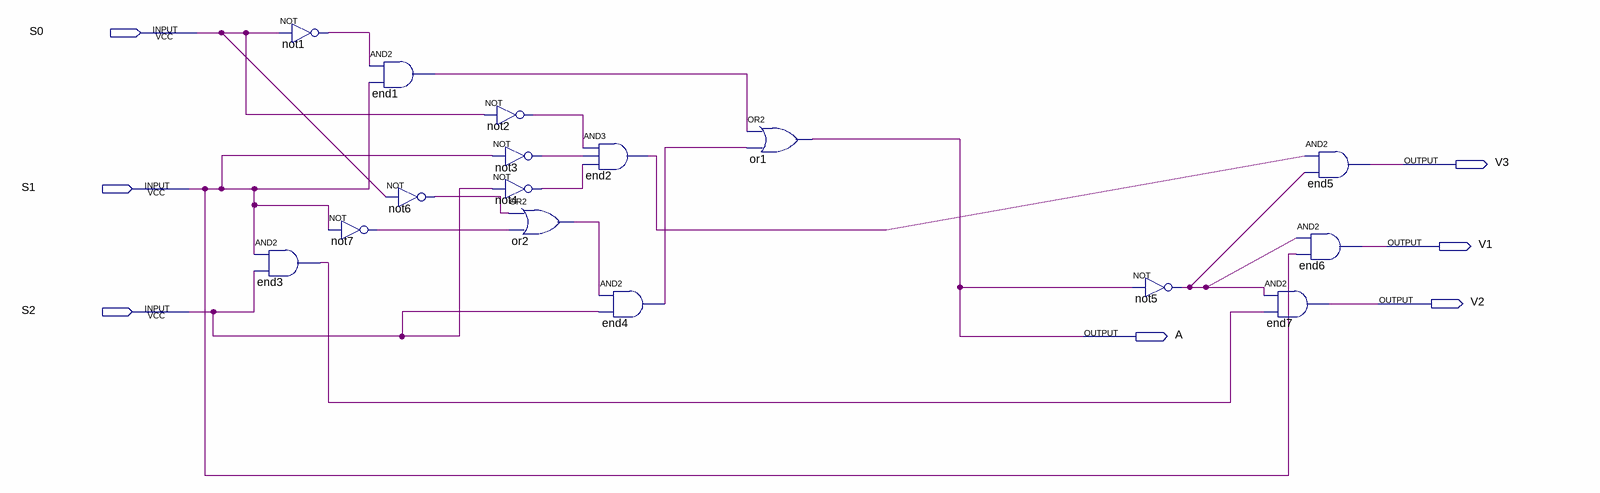
[diagram p0: schematic sheet]
// Quartus schematic exercicio.bdf as structural Verilog: 16 symbols, 7 pins
module exercicio (
  input  S0,
  input  S1,
  input  S2,
  output V3,
  output V1,
  output V2,
  output A
);

  wire end1_out, end2_out, end3_out, end4_out, not1_out, not2_out, not3_out, not4_out, not5_out, not6_out,
       not7_out, or2_out;

  and end3 (end3_out, S1, S2);
  not not1 (not1_out, S0);
  and end1 (end1_out, not1_out, S1);
  not not6 (not6_out, S0);
  not not7 (not7_out, S1);
  not not2 (not2_out, S0);
  not not3 (not3_out, S1);
  not not4 (not4_out, S2);
  or or2 (or2_out, not6_out, not7_out);
  and end2 (end2_out, not2_out, not3_out, not4_out);
  and end4 (end4_out, or2_out, S2);
  or or1 (A, end1_out, end4_out);
  not not5 (not5_out, A);
  and end5 (V3, end2_out, not5_out);
  and end6 (V1, not5_out, S1);
  and end7 (V2, not5_out, end3_out);
endmodule
